# Altium schematic sheet atmega2560_sch.SchDoc
size OrCAD B; SheetNumber: 1; SheetTotal: 1
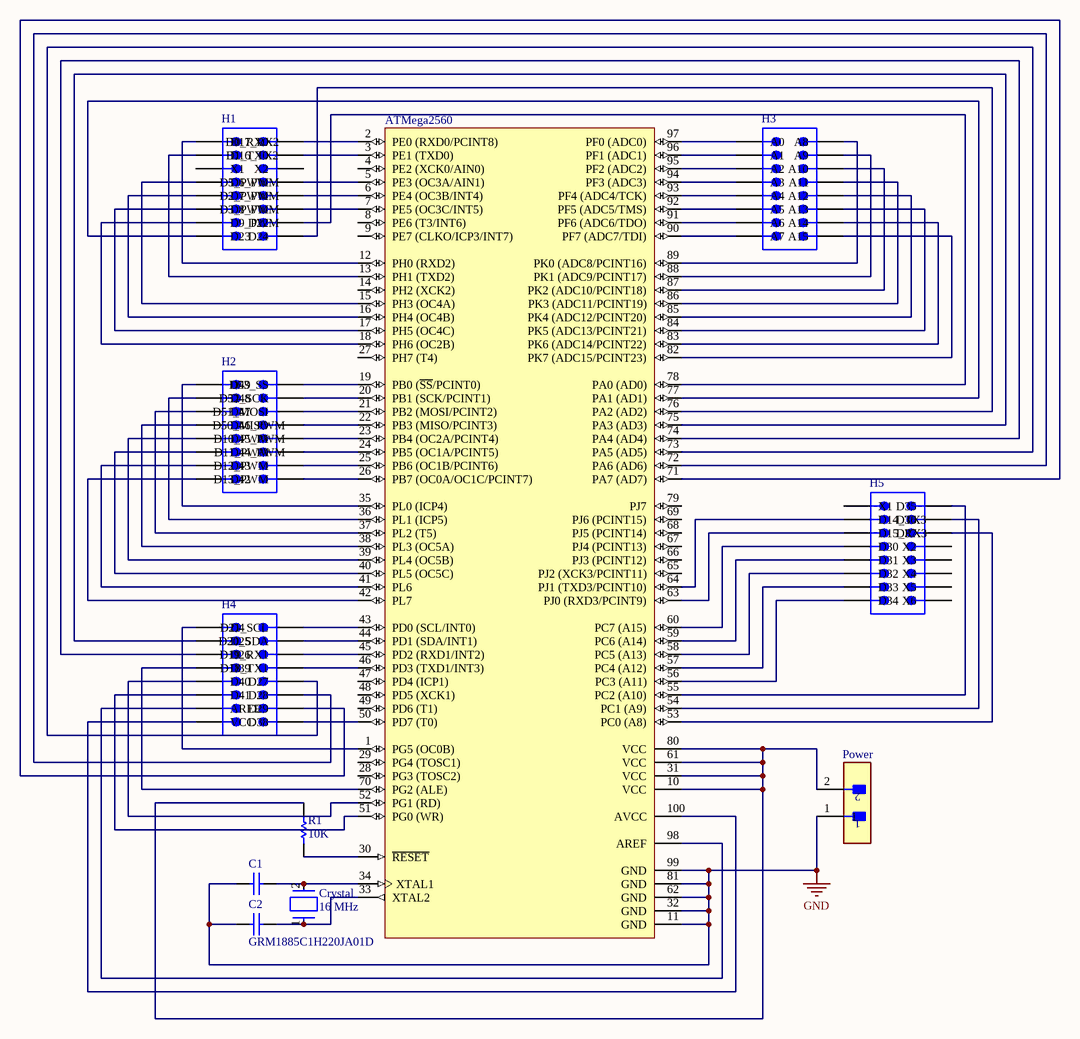
[diagram p0: atmega2560_sch.SchDoc]

## Parts
ATMega2560  ATmega2560-16AU  [100A_M]  (value not drawn)
C1  (no value)  [CAPC1608X90X35ML10T15]
C2  GRM1885C1H220JA01D  [CAPC1608X90X35ML10T15]
Crystal  16 MHz  [FP-ABLS-MFG]
H1  61301621121  [61301621121]  (value not drawn)
H2  61301621121  [61301621121]  (value not drawn)
H3  61301621121  [61301621121]  (value not drawn)
H4  61301621121  [61301621121]  (value not drawn)
H5  61301621121  [61301621121]  (value not drawn)
Power  TSW-102-07-G-S  [FP-TSW-102-07-G-S-MFG]  (value not drawn)
R1  10K  [RESC1608X55X25ML10T15]

## Nets
GND: ATMega2560.11(GND) ATMega2560.32(GND) ATMega2560.62(GND) ATMega2560.81(GND) ATMega2560.99(GND) C1.1 C2.1 Power.1
NetATMega2560_1: ATMega2560.1(PG5_(OC0B)) H4.1(D4)
NetATMega2560_2: ATMega2560.2(PE0_(RXD0/PCINT8)) H1.2(D0_RX0)
NetATMega2560_3: ATMega2560.3(PE1_(TXD0)) H1.4(D1_TX0)
NetATMega2560_5: ATMega2560.5(PE3_(OC3A/AIN1)) H1.8(D5_PWM)
NetATMega2560_6: ATMega2560.6(PE4_(OC3B/INT4)) H1.10(D2_PWM)
NetATMega2560_7: ATMega2560.7(PE5_(OC3C/INT5)) H1.12(D3_PWM)
NetATMega2560_10: ATMega2560.10(VCC) ATMega2560.31(VCC) ATMega2560.61(VCC) ATMega2560.80(VCC) Power.2 R1.2
NetATMega2560_12: ATMega2560.12(PH0_(RXD2)) H1.1(D17_RX2)
NetATMega2560_13: ATMega2560.13(PH1_(TXD2)) H1.3(D16_TX2)
NetATMega2560_15: ATMega2560.15(PH3_(OC4A)) H1.7(D6_PWM)
NetATMega2560_16: ATMega2560.16(PH4_(OC4B)) H1.9(D7_PWM)
NetATMega2560_17: ATMega2560.17(PH5_(OC4C)) H1.11(D8_PWM)
NetATMega2560_18: ATMega2560.18(PH6_(OC2B)) H1.13(D9_PWM)
NetATMega2560_19: ATMega2560.19(PB0_(~{SS}/PCINT0)) H2.2(D53_SS)
NetATMega2560_20: ATMega2560.20(PB1_(SCK/PCINT1)) H2.4(D52_SCK)
NetATMega2560_21: ATMega2560.21(PB2_(MOSI/PCINT2)) H2.6(D51_MOSI)
NetATMega2560_22: ATMega2560.22(PB3_(MISO/PCINT3)) H2.8(D50_MISO)
NetATMega2560_23: ATMega2560.23(PB4_(OC2A/PCINT4)) H2.10(D10_PWM)
NetATMega2560_24: ATMega2560.24(PB5_(OC1A/PCINT5)) H2.12(D11_PWM)
NetATMega2560_25: ATMega2560.25(PB6_(OC1B/PCINT6)) H2.14(D12_PWM)
NetATMega2560_26: ATMega2560.26(PB7_(OC0A/OC1C/PCINT7)) H2.16(D13_PWM)
NetATMega2560_30: ATMega2560.30(~{RESET}) R1.1
NetATMega2560_33: ATMega2560.33(XTAL2) C2.2 Crystal.1
NetATMega2560_34: ATMega2560.34(XTAL1) C1.2 Crystal.2
NetATMega2560_35: ATMega2560.35(PL0_(ICP4)) H2.1(D49)
NetATMega2560_36: ATMega2560.36(PL1_(ICP5)) H2.3(D48)
NetATMega2560_37: ATMega2560.37(PL2_(T5)) H2.5(D47)
NetATMega2560_38: ATMega2560.38(PL3_(OC5A)) H2.7(D46_PWM)
NetATMega2560_39: ATMega2560.39(PL4_(OC5B)) H2.9(D45_PWM)
NetATMega2560_40: ATMega2560.40(PL5_(OC5C)) H2.11(D44_PWM)
NetATMega2560_41: ATMega2560.41(PL6) H2.13(D43)
NetATMega2560_42: ATMega2560.42(PL7) H2.15(D42)
NetATMega2560_43: ATMega2560.43(PD0_(SCL/INT0)) H4.2(D21_SCL)
NetATMega2560_44: ATMega2560.44(PD1_(SDA/INT1)) H4.4(D20_SDA)
NetATMega2560_45: ATMega2560.45(PD2_(RXD1/INT2)) H4.6(D19_RX1)
NetATMega2560_46: ATMega2560.46(PD3_(TXD1/INT3)) H4.8(D18_TX1)
NetATMega2560_50: ATMega2560.50(PD7_(T0)) H4.16(D38)
NetATMega2560_51: ATMega2560.51(PG0_(WR)) H4.11(D41)
NetATMega2560_52: ATMega2560.52(PG1_(RD)) H4.9(D40)
NetATMega2560_53: ATMega2560.53(PC0_(A8)) H5.6(D37)
NetATMega2560_54: ATMega2560.54(PC1_(A9)) H5.4(D36)
NetATMega2560_55: ATMega2560.55(PC2_(A10)) H5.2(D35)
NetATMega2560_56: ATMega2560.56(PC3_(A11)) H5.15(D34)
NetATMega2560_57: ATMega2560.57(PC4_(A12)) H5.13(D33)
NetATMega2560_58: ATMega2560.58(PC5_(A13)) H5.11(D32)
NetATMega2560_59: ATMega2560.59(PC6_(A14)) H5.9(D31)
NetATMega2560_60: ATMega2560.60(PC7_(A15)) H5.7(D30)
NetATMega2560_63: ATMega2560.63(PJ0_(RXD3/PCINT9)) H5.5(D15_RX3)
NetATMega2560_64: ATMega2560.64(PJ1_(TXD3/PCINT10)) H5.3(D14_TX3)
NetATMega2560_70: ATMega2560.70(PG2_(ALE)) H4.7(D39)
NetATMega2560_71: ATMega2560.71(PA7_(AD7)) H4.14(D29)
NetATMega2560_72: ATMega2560.72(PA6_(AD6)) H4.12(D28)
NetATMega2560_73: ATMega2560.73(PA5_(AD5)) H4.10(D27)
NetATMega2560_74: ATMega2560.74(PA4_(AD4)) H4.5(D26)
NetATMega2560_75: ATMega2560.75(PA3_(AD3)) H4.3(D25)
NetATMega2560_76: ATMega2560.76(PA2_(AD2)) H1.16(D24)
NetATMega2560_77: ATMega2560.77(PA1_(AD1)) H1.15(D23)
NetATMega2560_78: ATMega2560.78(PA0_(AD0)) H1.14(D22)
NetATMega2560_82: ATMega2560.82(PK7_(ADC15/PCINT23)) H3.16(A15)
NetATMega2560_83: ATMega2560.83(PK6_(ADC14/PCINT22)) H3.14(A14)
NetATMega2560_84: ATMega2560.84(PK5_(ADC13/PCINT21)) H3.12(A13)
NetATMega2560_85: ATMega2560.85(PK4_(ADC12/PCINT20)) H3.10(A12)
NetATMega2560_86: ATMega2560.86(PK3_(ADC11/PCINT19)) H3.8(A11)
NetATMega2560_87: ATMega2560.87(PK2_(ADC10/PCINT18)) H3.6(A10)
NetATMega2560_88: ATMega2560.88(PK1_(ADC9/PCINT17)) H3.4(A9)
NetATMega2560_89: ATMega2560.89(PK0_(ADC8/PCINT16)) H3.2(A8)
NetATMega2560_90: ATMega2560.90(PF7_(ADC7/TDI)) H3.15(A7)
NetATMega2560_91: ATMega2560.91(PF6_(ADC6/TDO)) H3.13(A6)
NetATMega2560_92: ATMega2560.92(PF5_(ADC5/TMS)) H3.11(A5)
NetATMega2560_93: ATMega2560.93(PF4_(ADC4/TCK)) H3.9(A4)
NetATMega2560_94: ATMega2560.94(PF3_(ADC3)) H3.7(A3)
NetATMega2560_95: ATMega2560.95(PF2_(ADC2)) H3.5(A2)
NetATMega2560_96: ATMega2560.96(PF1_(ADC1)) H3.3(A1)
NetATMega2560_97: ATMega2560.97(PF0_(ADC0)) H3.1(A0)
NetATMega2560_98: ATMega2560.98(AREF) H4.13(AREF)
NetATMega2560_100: ATMega2560.100(AVCC) H4.15(VCC)

Not connected (* = marked no-connect by the designer): ATMega2560 4(PE2_(XCK0/AIN0)) 8(PE6_(T3/INT6)) 9(PE7_(CLKO/ICP3/INT7)) 14(PH2_(XCK2)) 27(PH7_(T4)) 28(PG3_(TOSC2)) 29(PG4_(TOSC1)) 47(PD4_(ICP1)) 48(PD5_(XCK1)) 49(PD6_(T1)) 65(PJ2_(XCK3/PCINT11)) 66(PJ3_(PCINT12)) 67(PJ4_(PCINT13)) 68(PJ5_(PCINT14)) 69(PJ6_(PCINT15)) 79(PJ7); H1 5(X1) 6(X2); H5 1(X1) 8(X2) 10(X3) 12(X4) 14(X5) 16(X6)

## Library data of the parts
ATMega2560 = CMP-0095-00210-2: 8-bit AVR Microcontroller, 4.5-5.5V, 16MHz, 256KB Flash, 4KB EEPROM, 8KB SRAM, 86 GPIO pins, 100-pin TQFP, Industrial Grade (-40°C to 85°C), Pb-Free; PackageDescription: 100-Pin Thin Profile Plastic Quad Flat Pack (TQFP), 14 x 14 x 1.0 mm Body, 0.5 mm Pitch; ComponentLink1Description: Manufacturer URL; ComponentLink3URL: http://www.atmel.com/dyn/resources/prod_documents/2549S.pdf; RevisionNote: DatasheetVersion & PackageVersion updated. URLs added.; DatasheetVersion: revN, May-2011; ComponentLink2Description: ATmega640/1280/1281/2560/2561 Datasheet; PackageReference: 100A; PackageVersion: revD, Oct-2010; Code_JEDEC: MS-026-AED; ComponentLink1URL: http://www.atmel.com/; ComponentLink2URL: http://www.atmel.com/dyn/resources/prod_documents/doc2549.pdf; ComponentLink3Description: ATmega640/1280/1281/2560/2561 Summary
C1 C2 = CMP-2000-04945-1: Chip Capacitor, 22 pF, +/- 5%, 50 V, -55 to 125 degC, 0603 (1608 Metric), RoHS, Tape and Reel; Manufacturer: Murata; Capacitance: 22pF; Rated Voltage: 50V; Dielectric: C0G; Manufacturer URL: http://www.murata.com/; Datasheet Version: Jul-06; Package Reference: 603; Tolerance (%): ±5%; Case Size/Dimension: 0603; Package Description: 2-Pin Surface Mount Device, Body 1.6 x 0.8 mm; Datasheet URL: https://datasheet.ciiva.com/11786/0900766b807a1cab-11786398.pdf
Crystal = CMP-27762-000003-1: CRYSTAL 16.0000MHZ 18PF SMD; Manufacturer Part Number: ABLS-16.000MHZ-K4T; Manufacturer: Abracon; Frequency: 16MHz; Stability: 50ppm; Tolerance: 30ppm; Standoff Height: 0mm; Esr: 40Ω; ComponentLink2URL: https://abracon.com/Resonators/abls.pdf; Temperature Range High: +125°C; Package: ABLS; Device Class L3: Crystals; Temperature: -40°C to +125°C; Load Capacitance: 18pF; Device Class L2: Crystals / Oscillators; Mouser Description: Crystal 16MHz ±30ppm (Tol) ±50ppm (Stability) 18pF FUND 40Ohm 2-Pin HC-49/US SMD T/R; Category: Crys; ComponentLink2Description: Datasheet; Series: ABLS; Automotive: No; Octopart: https://octopart.com/abls-16.000mhz-k4t-abracon-18618626; RoHS: TRUE; Digikey Description: CRYSTAL 16.0000MHZ 18PF SMD; Temperature Range Low: -40°C; Lead Free: Yes; Height: 4.3mm; Device Class L1: Passive Components
H1-H5 = CMP-1502-01097-3: NexarPartId: 32855550; Contact Resistance: 20mΩ; Operating Supply Voltage: 250V; Number of Contacts: 16; Current Rating: 3A; Connector Type: Male Pin; Row Spacing: 2.54mm; Gender: Male; Min Operating Temperature: -40°C; Contact Material: Copper; RoHS: Compliant; Lead Pitch: 2.54mm; Color: Black; Contact Mating Length: 5.9944mm; REACH SVHC: Unknown; Number of Rows: 2; Orientation: Vertical; Number of Positions: 16; Max Operating Temperature: 105°C; Termination: Solder; Packaging: Bulk; Height: 8.89mm; Mount: Through Hole; Contact Plating: Gold; Voltage Rating: 250V; Number of Pins: 16; Pitch: 2.54mm
Power = CMP-02766-000084-1: CONN HEADER VERT 2POS 2.54MM; Manufacturer: Samtec; Number Of Contacts: 2; Voltage Rating: 550V; Conn Orientation: Straight; Current Rating: 6.3A; Conn Gender: Male; Package: TSW-102-07-G-S; Digikey Description: CONN HEADER VERT 2POS 2.54MM; ComponentLink2URL: http://suddendocs.samtec.com/catalog_english/tsw_th.pdf; Height: 8.71mm; Temperature: -55°C to +125°C; Device Class L2: Headers and Wire Housings; ComponentLink2Description: Datasheet; Device Class L3: unset; Contact Material: Gold,Nickel; Temperature Range Low: -55°C; Temperature Range High: +125°C; RoHS: TRUE; Device Class L1: Connectors; Mouser Description: Conn Unshrouded Header HDR 2 POS 2.54mm Solder ST Thru-Hole Automotive Bulk; Number Of Rows: 1; Category: Conn; Pitch: 2.54mm; Lead Free: Yes; Automotive: No; Manufacturer Part Number: TSW-102-07-G-S; Footprint Url: http://suddendocs.samtec.com/prints/tsw-xxx-xx-x-x-xx-xxx-footprint.pdf; Octopart: https://octopart.com/tsw-102-07-g-s-samtec-272197
R1 = CMP-2000-05022-1: Resistor, 10 KOhm, +/- 5%, 100 mW, -55 to 155 degC, 0603 (1608 Metric), RoHS, Tape and Reel; Manufacturer: Yageo; Resistance: 10kOhms; Voltage Rating: 50V; Temperature Coefficient: 100PPM/C; Power Rating: 100mW; Package Reference: 603; Series: RC; Case Code - mm: 1608; Packaging: Reel; Datasheet URL: http://www.farnell.com/datasheets/443971.pdf; Datasheet Version: Rev. 4, 04/2009; Operating Temperature Range: -55Cto+155C; Product: ThickFilmResistorsGeneralPurpose; Package Description: 2-Pin Surface Mount Device, Body 1.6 x 0.8 mm; Manufacturer URL: http://www.yageo.com/; Case Code - in: 0603; Tolerance: 5%; Termination Style: SMD/SMT